# EAGLE design ic735-bandswitch (EAGLE 7.4.0)
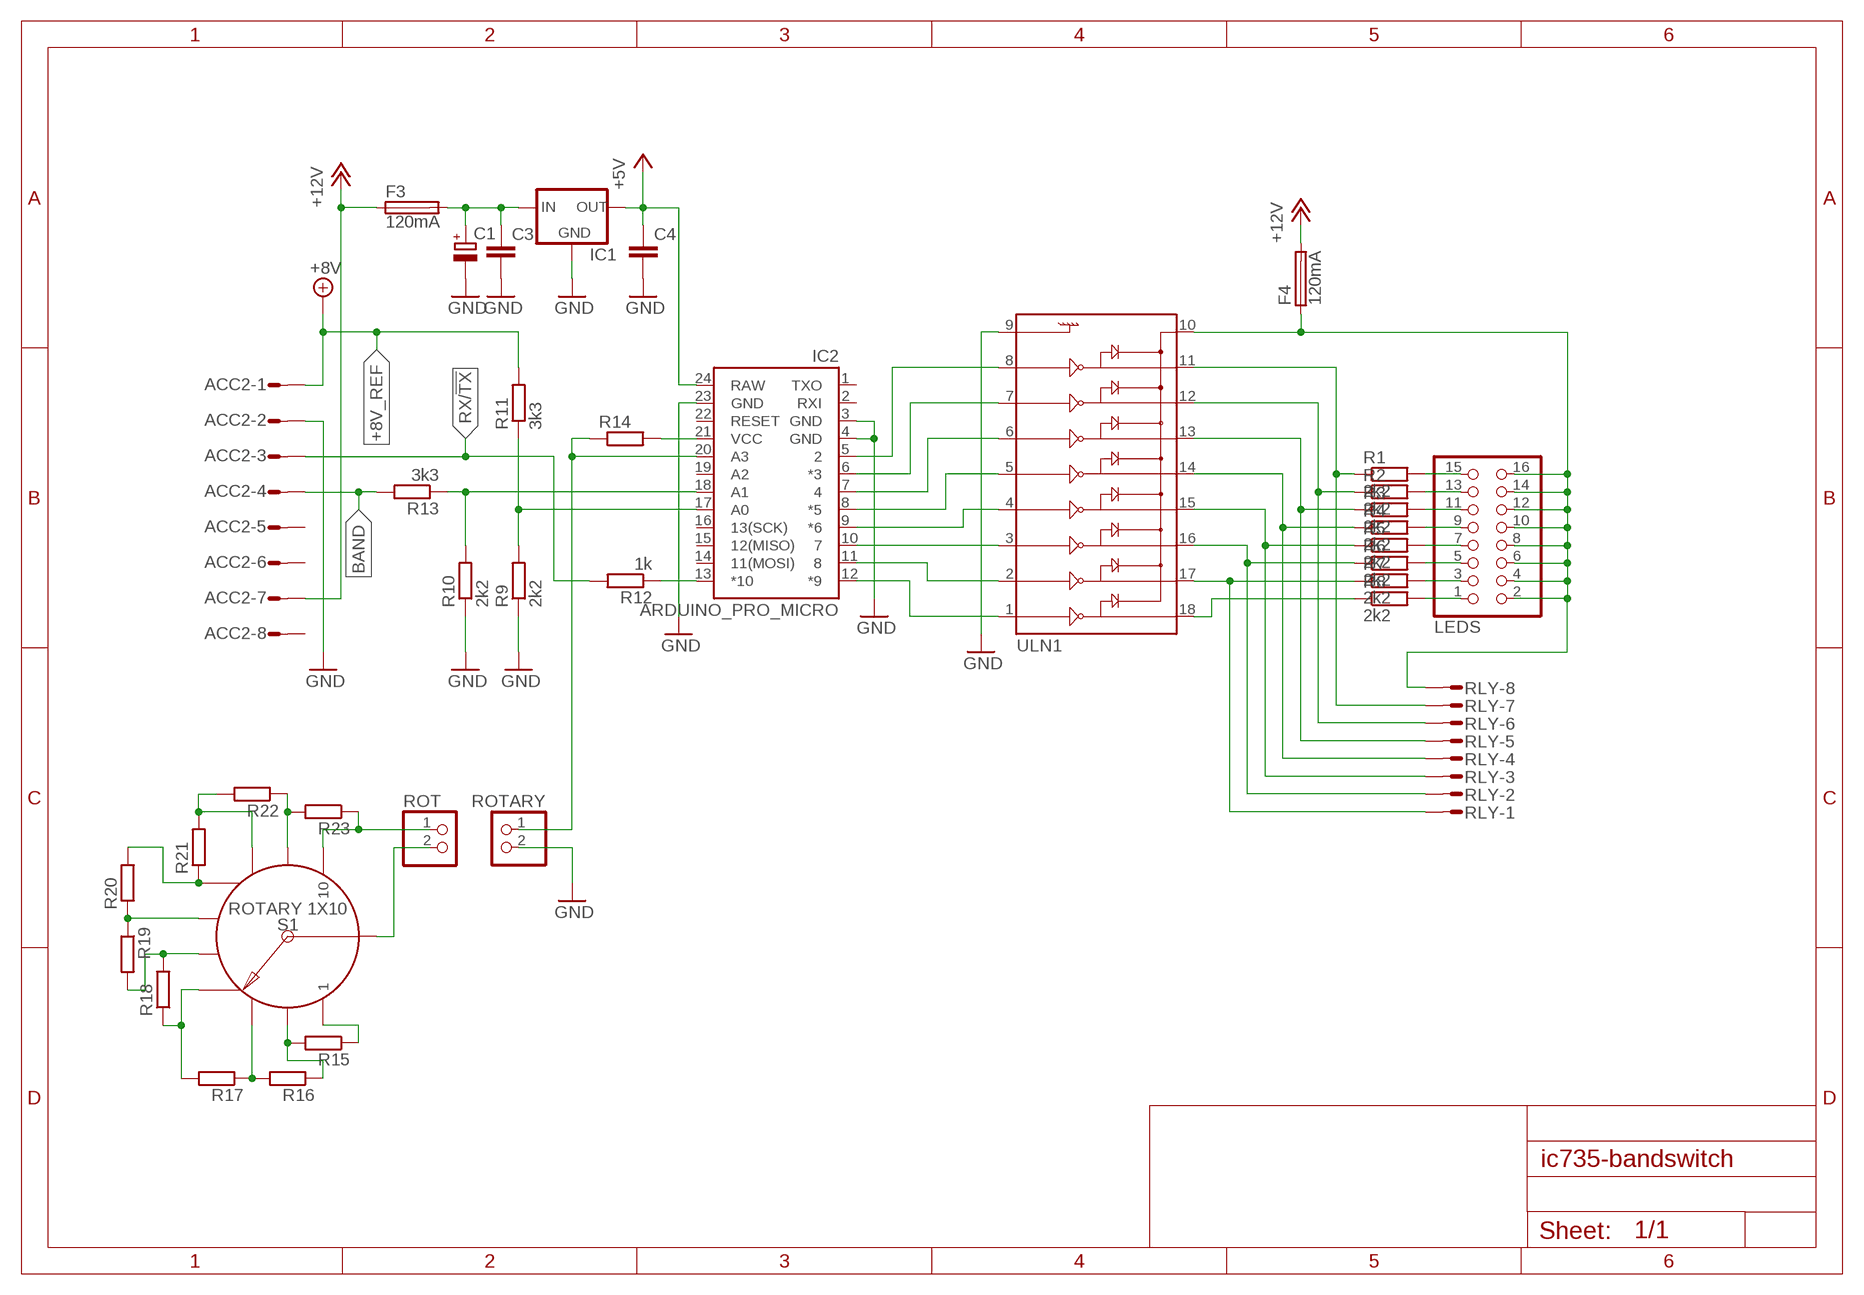
[diagram p0: schematic, sheet 1]

## Parts
ACC2  S08P  [S08P]
C1  CPOL-EUE2,5-6E  [E2,5-6E]
C3  C-EU025-024X044  [C025-024X044]
C4  C-EU025-024X044  [C025-024X044]
F3  120mA  TE5  [TE5]
F4  120mA  TE5  [TE5]
IC1  78XXS  [78XXS]
IC2  ARDUINO_PRO_MICRO  [ARDUINO_PRO_MICRO]
LEDS  PINHD-2X8  [2X08]
R1  2k2  R-EU_R0603  [R0603]
R2  2k2  R-EU_R0603  [R0603]
R3  2k2  R-EU_R0603  [R0603]
R4  2k2  R-EU_R0603  [R0603]
R5  2k2  R-EU_R0603  [R0603]
R6  2k2  R-EU_R0603  [R0603]
R7  2k2  R-EU_R0603  [R0603]
R8  2k2  R-EU_R0603  [R0603]
R9  2k2  R-EU_R0603  [R0603]
R10  2k2  R-EU_R0603  [R0603]
R11  3k3  R-EU_R0603  [R0603]
R12  1k  R-EU_R0603  [R0603]
R13  3k3  R-EU_R0603  [R0603]
R14  R-EU_R0603  [R0603]
R15  R-EU_R0603  [R0603]
R16  R-EU_R0603  [R0603]
R17  R-EU_R0603  [R0603]
R18  R-EU_R0603  [R0603]
R19  R-EU_R0603  [R0603]
R20  R-EU_R0603  [R0603]
R21  R-EU_R0603  [R0603]
R22  R-EU_R0603  [R0603]
R23  R-EU_R0603  [R0603]
RLY  S08P  [S08P]
ROT  PINHD-1X2  [1X02]
ROTARY  PINHD-1X2  [1X02]
S1  ROTARY 1X10  SWITCH_ROTARY_1X10-PTH  [ROTARY_SWITCH_1X10]
ULN1  ULN2803DIP  [DIL18]

## Nets
+5V: C4.1 IC1.OUT IC2.24(RAW)
+8V_REF: ACC2.1 R11.2 ; supply symbol labelled +8V
+12V: ACC2.7 F3.1 F4.2
BAND: ACC2.4 R13.2
GND: ACC2.2 C1.- C3.2 C4.2 IC1.GND IC2.3(GND) IC2.4(GND) IC2.23(GND) R9.1 R10.1 ROTARY.2 ULN1.9
N$1: IC2.5 ULN1.8
N$2: IC2.6(*3) ULN1.7
N$3: IC2.7 ULN1.6
N$4: IC2.8(*5) ULN1.5
N$5: IC2.9(*6) ULN1.4
N$6: IC2.10 ULN1.3
N$7: IC2.12(*9) ULN1.1
N$8: IC2.11 ULN1.2
N$9: LEDS.15 R1.2
N$10: LEDS.13 R2.2
N$11: LEDS.11 R3.2
N$12: LEDS.9 R4.2
N$13: LEDS.7 R5.2
N$14: LEDS.5 R6.2
N$15: LEDS.3 R7.2
N$16: LEDS.1 R8.2
N$17: IC2.18(A1) R10.2 R13.1
N$18: R7.1 RLY.1 ULN1.17
N$19: R6.1 RLY.2 ULN1.16
N$20: R5.1 RLY.3 ULN1.15
N$21: R4.1 RLY.4 ULN1.14
N$22: R3.1 RLY.5 ULN1.13
N$23: R2.1 RLY.6 ULN1.12
N$24: R1.1 RLY.7 ULN1.11
N$25: R8.1 ULN1.18
N$26: IC2.17(A0) R9.2 R11.1
N$27: IC2.13(*10) R12.1
N$28: IC2.20(A3) R14.1 ROTARY.1
N$29: IC2.21(VCC) R14.2
N$30: C1.+ C3.1 F3.2 IC1.IN
N$31: F4.1 LEDS.2 LEDS.4 LEDS.6 LEDS.8 LEDS.10 LEDS.12 LEDS.14 LEDS.16 RLY.8 ULN1.10
N$32: R15.1 S1.1
N$33: R15.2 R16.1 S1.2
N$34: R23.1 ROT.1 S1.10
N$35: R16.2 R17.1 S1.3
N$36: R19.1 R20.1 S1.6
N$37: R17.2 R18.1 S1.4
N$38: R18.2 R19.2 S1.5
N$39: ROT.2 S1.COMMON
N$40: R20.2 R21.1 S1.7
N$41: R21.2 R22.2 S1.8
N$42: R22.1 R23.2 S1.9
RX/!TX: ACC2.3 R12.2
Unconnected: ACC2.5 ACC2.6 ACC2.8 IC2.1(TXO) IC2.2(RXI) IC2.14(11(MOSI)) IC2.15(12(MISO)) IC2.16(13(SCK)) IC2.19(A2) IC2.22(RESET)

## Library data of the parts
ACC2 RLY = con-amp-mt:S08P: AMP MT CONNECTOR; OC_FARNELL: unknown; OC_NEWARK: unknown
C1 = rcl:CPOL-EU: POLARIZED CAPACITOR, European symbol
C3 C4 = rcl:C-EU: CAPACITOR, European symbol
F3 F4 = fuse:TE5: FUSE Wickmann
IC1 = v-reg:78XXS: VOLTAGE REGULATOR
IC2 = SparkFun-Boards:ARDUINO_PRO_MICRO
LEDS = pinhead:PINHD-2X8: PIN HEADER
R1-R23 = rcl:R-EU_: RESISTOR, European symbol
ROT ROTARY = pinhead:PINHD-1X2: PIN HEADER
S1 = SparkFun-Switches:SWITCH_ROTARY_1X10: 10-Position Rotary Switch Single pole, 10 position rotary switch able to select up to 10 different states. SparkFun Products Rotary Switch - 10 Position <https://www.sparkfun.com/products/13253> (COM-13253) Used on SparkFun Decade Resistance Box <https://www.sparkfun.com/products/13006>; PROD_ID: SWCH-12120; SF_SKU: COM-13253
ULN1 = SparkFun-PowerIC:ULN2803: Darlington Driver ULN2803 Darlington array. 500mA max per channel, 8-channel package. Spark Fun Electronics SKU : COM-00312

## Board
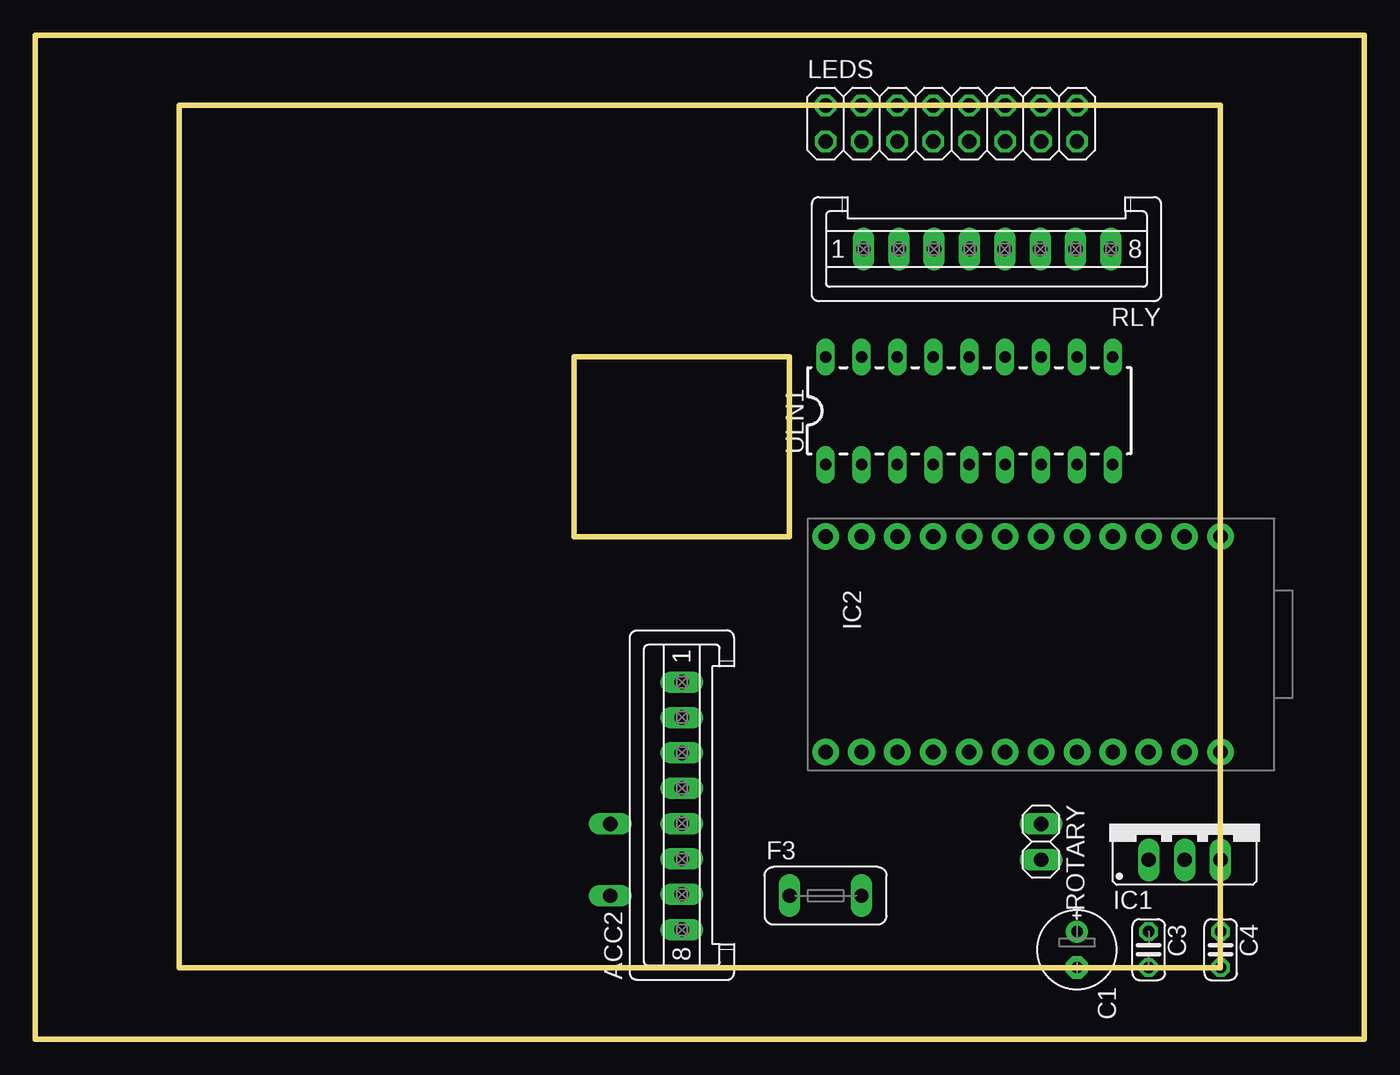
[diagram p1: board, top side]
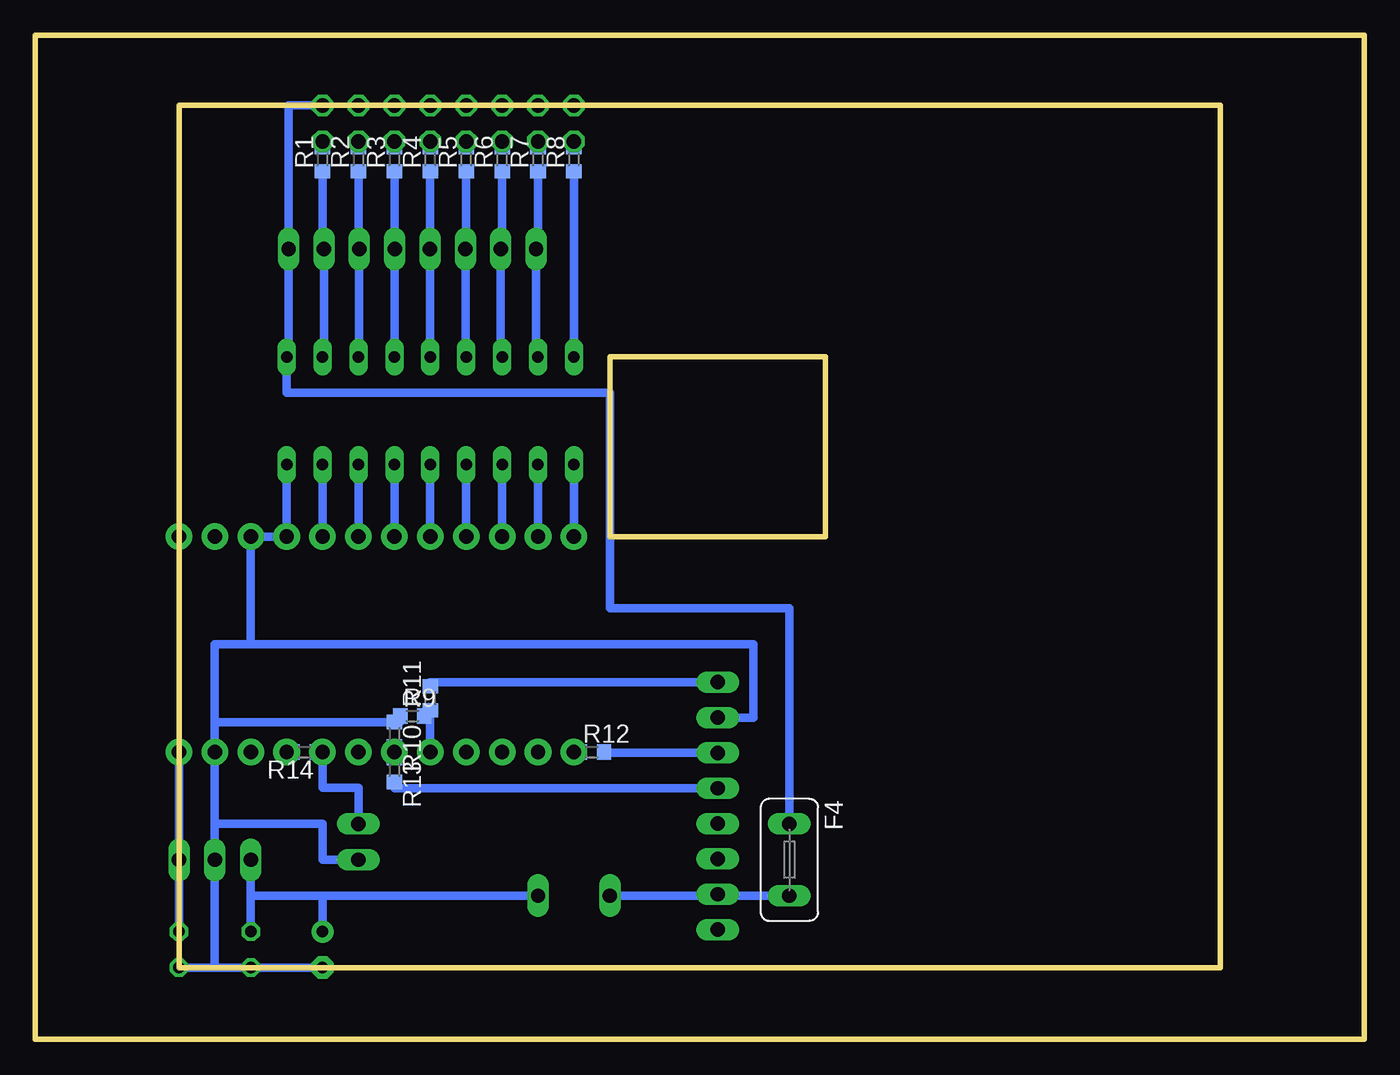
[diagram p2: board, bottom side, seen from below]

Size 94 x 71 mm. Coordinates in mm from the lower left corner, seen from the top.
Outline: 94,0 0,0 0,71 94,71 94,0
Outline: 10.18,5.08 83.84,5.08 83.84,66.04 10.18,66.04 10.18,5.08
Outline: 53.36,35.56 38.12,35.56 38.12,48.26 53.36,48.26 53.36,35.56
Copper layers (1*16): Top 0.035mm / dielectric 1.5mm / Bottom 0.035mm
Design rules "default": minimum track width 10mil, minimum drill 24mil, track to track 8mil, track to pad 8mil, pad to pad 8mil, via to via 8mil, smd to smd 8mil, copper to edge 40mil, drill to drill 8mil, minimum pad ring 10mil, minimum via ring 8mil, stop-mask expansion 4mil, vias tented up to drill 0mil, thermal gap 10mil

### Footprints (pad centres in the part's own frame; a part is rotated, then mirrored left to right if it is on the bottom)
S08P = drill 1.016 long: 1 8.75,0; 2 6.25,0; 3 3.75,0; 4 1.25,0; 5 -1.25,0; 6 -3.75,0; 7 -6.25,0; 8 -8.75,0
E2,5-6E = drill 0.813 pad 1.575: + -1.27,0 | drill 0.813 pad 1.575 octagon: - 1.27,0
C025-024X044 = drill 0.813 octagon: 1 -1.27,0; 2 1.27,0
TE5 = drill 1.016 long: 1 -2.54,0; 2 2.54,0
78XXS = drill 1.016 long: GND 0,-2.54; IN -2.54,-2.54; OUT 2.54,-2.54
ARDUINO_PRO_MICRO = drill 1.016 pad 1.88: 1 -7.62,12.7; 2 -7.62,10.16; 3 -7.62,7.62; 4 -7.62,5.08; 5 -7.62,2.54; 6 -7.62,0; 7 -7.62,-2.54; 8 -7.62,-5.08; 9 -7.62,-7.62; 10 -7.62,-10.16; 11 -7.62,-12.7; 12 -7.62,-15.24; 13 7.62,-15.24; 14 7.62,-12.7; 15 7.62,-10.16; 16 7.62,-7.62; 17 7.62,-5.08; 18 7.62,-2.54; 19 7.62,0; 20 7.62,2.54; 21 7.62,5.08; 22 7.62,7.62; 23 7.62,10.16; 24 7.62,12.7
2X08 = drill 1.016 octagon: 1 -8.89,-1.27; 2 -8.89,1.27; 3 -6.35,-1.27; 4 -6.35,1.27; 5 -3.81,-1.27; 6 -3.81,1.27; 7 -1.27,-1.27; 8 -1.27,1.27; 9 1.27,-1.27; 10 1.27,1.27; 11 3.81,-1.27; 12 3.81,1.27; 13 6.35,-1.27; 14 6.35,1.27; 15 8.89,-1.27; 16 8.89,1.27
R0603 = smd 1 x 1.1: 1 -0.85,0; 2 0.85,0
1X02 = drill 1.016 long: 1 -1.27,0; 2 1.27,0
ROTARY_SWITCH_1X10 = drill 1.4: 1 7.071,7.071; 2 9.659,2.588; 3 9.659,-2.588; 4 7.071,-7.071; 5 2.588,-9.659; 6 -2.588,-9.659; 7 -7.071,-7.071; 8 -9.659,-2.588; 9 -9.659,2.588; 10 -7.071,7.071; COMMON 0,-5.5
DIL18 = drill 0.813 long: 1 -10.16,-3.81; 2 -7.62,-3.81; 3 -5.08,-3.81; 4 -2.54,-3.81; 5 0,-3.81; 6 2.54,-3.81; 7 5.08,-3.81; 8 7.62,-3.81; 9 10.16,-3.81; 10 10.16,3.81; 11 7.62,3.81; 12 5.08,3.81; 13 2.54,3.81; 14 0,3.81; 15 -2.54,3.81; 16 -5.08,3.81; 17 -7.62,3.81; 18 -10.16,3.81

### Placement (x,y rotation side)
ACC2  45.74,16.51 90 top
C1  73.68,6.35 270 top
C3  78.76,6.35 270 top
C4  83.84,6.35 270 top
F3  55.9,10.16 0 top
F4  40.66,12.7 270 bottom
IC1  81.3,15.24 0 top
IC2  71.14,27.94 270 top
LEDS  64.79,64.77 0 top
R1  73.68,62.23 90 bottom
R2  71.14,62.23 90 bottom
R3  68.6,62.23 90 bottom
R4  66.06,62.23 90 bottom
R5  63.52,62.23 90 bottom
R6  60.98,62.23 90 bottom
R7  58.44,62.23 90 bottom
R8  55.9,62.23 90 bottom
R9  67.33,22.86 0 bottom
R10  68.6,21.59 270 bottom
R11  66.06,24.13 90 bottom
R12  54.63,20.32 0 bottom
R13  68.6,19.05 270 bottom
R14  74.95,20.32 180 bottom
R15  119.4,27.94 315 top  (outside the outline)
R16  121.94,22.86 270 top  (outside the outline)
R17  119.4,17.78 225 top  (outside the outline)
R18  116.86,15.24 180 top  (outside the outline)
R19  111.78,12.7 0 top  (outside the outline)
R20  106.7,15.24 180 top  (outside the outline)
R21  104.16,17.78 135 top  (outside the outline)
R22  101.62,20.32 270 top  (outside the outline)
R23  104.16,27.94 225 top  (outside the outline)
RLY  67.33,55.88 180 top
ROT  111.78,40.64 0 top  (outside the outline)
ROTARY  71.14,13.97 270 top
S1  111.78,22.86 0 top  (outside the outline)
ULN1  66.06,44.45 0 top

### Tracks (layer width: path | path; a pad name or v marks a point on that pad's centre or on a via)
+5V
  Bottom 0.61: IC2.24 IC1.OUT C4.1
+8V_REF
  Bottom 0.61: ACC2.1 66.06,25.26 R11.2
+12V
  Bottom 0.61: F3.1 45.74,10.16 | F4.2 45.74,10.16 | 45.74,10.16 ACC2.7
BAND
  Bottom 0.61: ACC2.4 68.6,17.76 R13.2
GND
  Bottom 0.61: ACC2.2 43.2,22.76 43.2,27.94 78.76,27.94 | 78.76,27.94 81.3,27.94 81.3,22.44 | 81.3,22.44 IC2.23 81.3,15.24 | 81.3,15.24 IC1.GND 81.3,5.08 | R9.1 68.18,22.44 R10.1 81.3,22.44 | 78.76,27.94 IC2.3 IC2.4 ULN1.9 | ROTARY.2 73.68,12.7 73.68,15.24 81.3,15.24 | 81.3,5.08 C4.2 | C1.- C3.2 81.3,5.08
N$1
  Bottom 0.61: IC2.5 ULN1.8
N$2
  Bottom 0.61: IC2.6 ULN1.7
N$3
  Bottom 0.61: IC2.7 ULN1.6
N$4
  Bottom 0.61: IC2.8 ULN1.5
N$5
  Bottom 0.61: IC2.9 ULN1.4
N$6
  Bottom 0.61: IC2.10 ULN1.3
N$7
  Bottom 0.61: IC2.12 ULN1.1
N$8
  Bottom 0.61: IC2.11 ULN1.2
N$9
  Bottom 0.61: R1.2 LEDS.15
N$10
  Bottom 0.61: R2.2 LEDS.13
N$11
  Bottom 0.61: R3.2 LEDS.11
N$12
  Bottom 0.61: R4.2 LEDS.9
N$13
  Bottom 0.61: R5.2 LEDS.7
N$14
  Bottom 0.61: R6.2 LEDS.5
N$15
  Bottom 0.61: R7.2 LEDS.3
N$16
  Bottom 0.61: R8.2 LEDS.1
N$17
  Bottom 0.61: R10.2 IC2.18 R13.1
N$18
  Bottom 0.61: R7.1 58.44,55.88 RLY.1 58.58,48.26 ULN1.17
N$19
  Bottom 0.61: R6.1 60.98,55.88 RLY.2 61.08,48.26 ULN1.16
N$20
  Bottom 0.61: R5.1 63.52,55.88 RLY.3 63.58,48.26 ULN1.15
N$21
  Bottom 0.61: 66.06,55.88 R4.1 | ULN1.14 66.06,55.88 | 66.06,55.88 RLY.4
N$22
  Bottom 0.61: R3.1 68.6,55.88 RLY.5 68.58,48.26 ULN1.13
N$23
  Bottom 0.61: R2.1 71.14,55.88 RLY.6 71.08,48.26 ULN1.12
N$24
  Bottom 0.61: R1.1 73.68,55.88 RLY.7 73.58,48.26 ULN1.11
N$25
  Bottom 0.61: ULN1.18 R8.1
N$26
  Bottom 0.61: IC2.17 R11.1 66.06,22.86 R9.2
N$27
  Bottom 0.61: R12.1 IC2.13
N$28
  Bottom 0.61: R14.1 IC2.20 73.68,17.78 71.14,17.78 ROTARY.1
N$29
  Bottom 0.61: R14.2 IC2.21
N$30
  Bottom 0.61: C3.1 78.76,10.16 | 78.76,10.16 IC1.IN | F3.2 73.68,10.16 | 73.68,10.16 78.76,10.16 | C1.+ 73.68,10.16
N$31  (7 unrouted)
  Bottom 0.61: LEDS.16 76.08,66.04 RLY.8 76.08,48.26 ULN1.10 76.22,45.72 53.36,45.72 53.36,30.48 40.66,30.48 F4.1
N$32  (1 unrouted)
N$33  (2 unrouted)
N$34  (2 unrouted)
N$35  (2 unrouted)
N$36  (2 unrouted)
N$37  (2 unrouted)
N$38  (2 unrouted)
N$39  (1 unrouted)
N$40  (2 unrouted)
N$41  (2 unrouted)
N$42  (2 unrouted)
RX/!TX
  Bottom 0.61: ACC2.3 53.78,20.26 R12.2

### Text on the board
Document: 30 | 25 | 20 | 15 | 10 | 5 | 1 | A | B | C | D | E | F | G | H | I | J | K | L | M | N | O | P | Q | R | S | T | U | V | W | X | Y